# EAGLE design pyIMU_GPS (EAGLE 6.5.0)
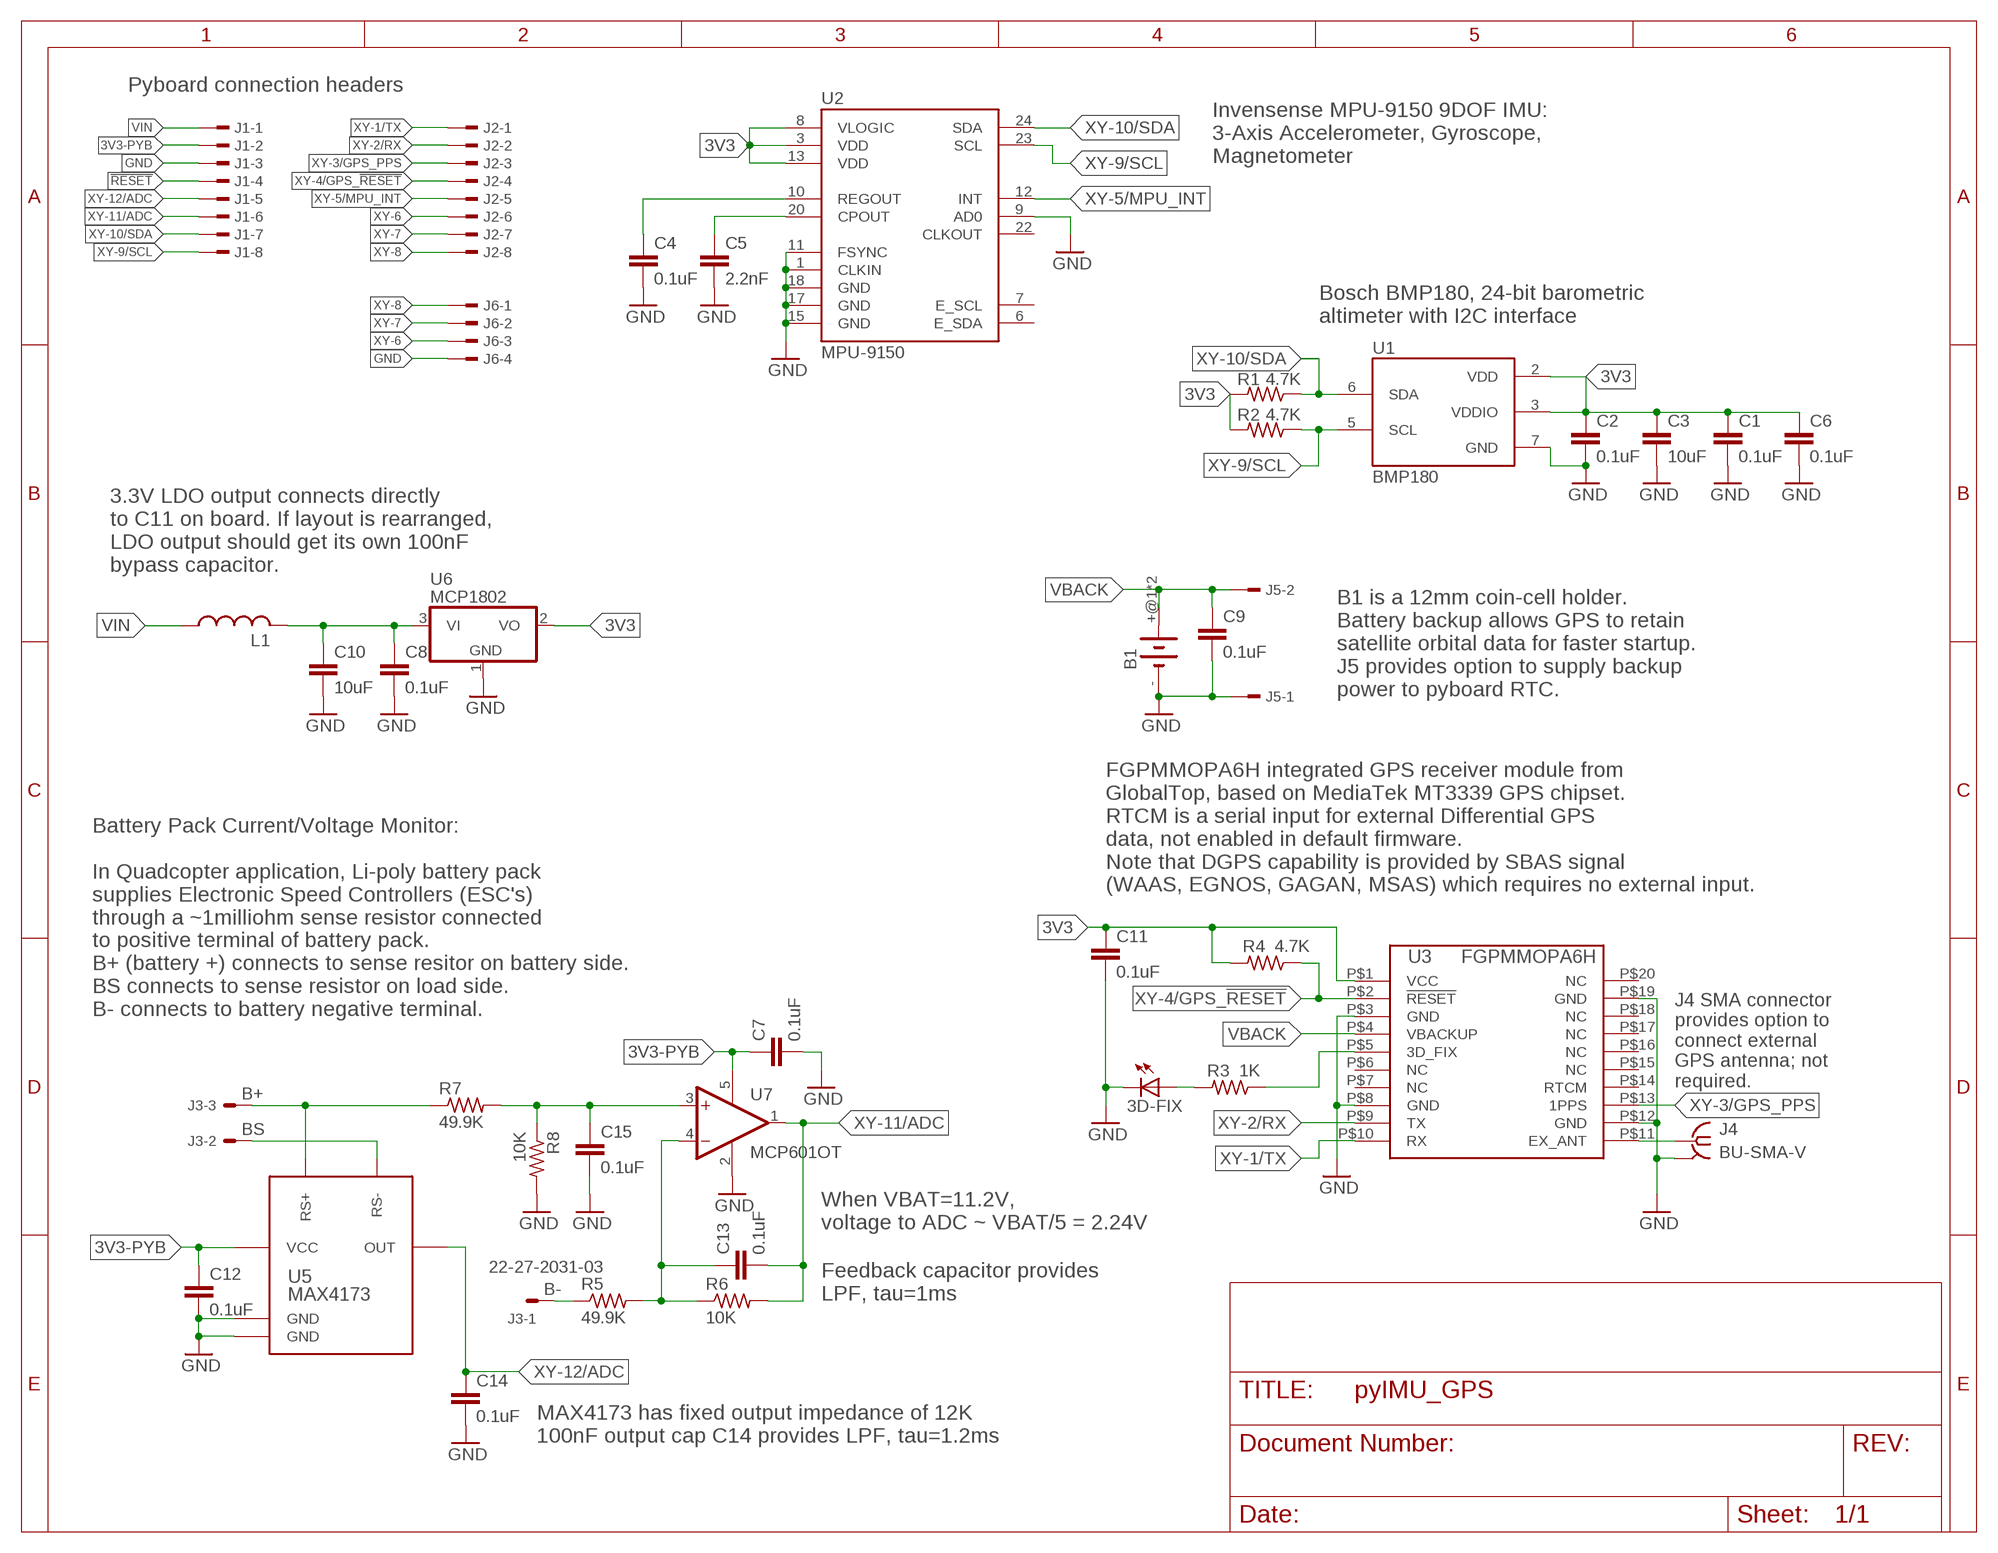
[diagram p0: schematic, sheet 1]

## Parts
3D-FIX  LEDCHIPLED_0805  [CHIPLED_0805]
B1  BATT_HOLDERK3000  [KEYSTONE-3000]
C1  0.1uF  C-EUC0603K  [C0603K]
C2  0.1uF  C-EUC0603K  [C0603K]
C3  10uF  C-EUC0805K  [C0805K]
C4  0.1uF  C-EUC0603K  [C0603K]
C5  2.2nF  C-EUC0603K  [C0603K]
C6  0.1uF  C-EUC0603K  [C0603K]
C7  0.1uF  C-EUC0603K  [C0603K]
C8  0.1uF  C-EUC0603K  [C0603K]
C9  0.1uF  C-EUC0603K  [C0603K]
C10  10uF  C-EUC0805K  [C0805K]
C11  0.1uF  C-EUC0603K  [C0603K]
C12  0.1uF  C-EUC0603K  [C0603K]
C13  0.1uF  C-EUC0603K  [C0603K]
C14  0.1uF  C-EUC0603K  [C0603K]
C15  0.1uF  C-EUC0603K  [C0603K]
J1  TSW-108-02-S-S-MOD  [TSW-108-02-S-S-MOD]
J2  TSW-108-02-S-S-MOD  [TSW-108-02-S-S-MOD]
J3  22-27-2031-03  [6410-03]
J4  BU-SMA-V  [BU-SMA-V]
J5  TSW-102-02-S-S  [TSW-102-02-S-S]
J6  TSW-104-02-S-S  [TSW-104-S-S-MOD]
L1  L-USL3216C  [L3216C]
R1  4.7K  R-US_R0603  [R0603]
R2  4.7K  R-US_R0603  [R0603]
R3  1K  R-US_R0603  [R0603]
R4  4.7K  R-US_R0603  [R0603]
R5  49.9K  R-US_R0805  [R0805]
R6  10K  R-US_R0805  [R0805]
R7  49.9K  R-US_R0805  [R0805]
R8  10K  R-US_R0805  [R0805]
U1  BMP180  [BMP180]
U2  MPU-9150  MPU-9150QFN-24-NP  [QFN-24-NP]
U3  FGPMMOPA6H  [FGPMMOPA6H]
U5  MAX4173  [SOT23-6L]
U6  MCP1802  MCP1703CB  [SOT23]
U7  MCP601OT  [SOT23-5]

## Nets
3V3: C1.1 C2.1 C3.1 C6.1 C11.1 R1.2 R2.2 R4.2 U1.2(VDD) U1.3(VDDIO) U2.3(VDD) U2.8(VLOGIC) U2.13(VDD) U3.P$1(VCC) U6.2(VO)
3V3-PYB: C7.1 C12.1 J1.2 U5.3(VCC) U7.5(V+)
!RESET: J1.4
B+: J3.3 R7.1 U5.4(RS+)
B-: J3.1 R5.1
BS: J3.2 U5.5(RS-)
GND: 3D-FIX.C B1.- C1.2 C2.2 C3.2 C4.2 C5.2 C6.2 C7.2 C8.2 C9.2 C10.2 C11.2 C12.2 C14.2 C15.2 J1.3 J4.2 J4.3 J4.4 J4.5 J5.1 J6.4 R8.2 U1.7(GND) U2.1(CLKIN) U2.9(AD0) U2.11(FSYNC) U2.15(GND) U2.17(GND) U2.18(GND) U3.P$3(GND) U3.P$8(GND) U3.P$12(GND) U3.P$19(GND) U5.1(GND) U5.2(GND) U6.1(GND) U7.2(V-)
N$1: C4.1 U2.10(REGOUT)
N$2: C5.1 U2.20(CPOUT)
N$3: J4.1 U3.P$11(EX_ANT)
N$4: R3.1 U3.P$5(3D_FIX)
N$5: 3D-FIX.A R3.2
N$6: C15.1 R7.2 R8.1 U7.3(+IN)
N$8: C13.1 R5.2 R6.1 U7.4(-IN)
N$11: C8.1 C10.1 L1.2 U6.3(VI)
VBACK: B1.+@1(+) B1.+@2(+) C9.1 J5.2 U3.P$4(VBACKUP)
VIN: J1.1 L1.1
XY-1/TX: J2.1 U3.P$10(RX)
XY-2/RX: J2.2 U3.P$9(TX)
XY-3/GPS_PPS: J2.3 U3.P$13(1PPS)
XY-4/GPS_!RESET: J2.4 R4.1 U3.P$2(!RESET)
XY-5/MPU_INT: J2.5 U2.12(INT)
XY-6: J2.6 J6.3
XY-7: J2.7 J6.2
XY-8: J2.8 J6.1
XY-9/SCL: J1.8 R2.1 U1.5(SCL) U2.23(SCL)
XY-10/SDA: J1.7 R1.1 U1.6(SDA) U2.24(SDA)
XY-11/ADC: C13.2 J1.6 R6.2 U7.1(OUT)
XY-12/ADC: C14.1 J1.5 U5.6(OUT)
Unconnected: U2.6(E_SDA) U2.7(E_SCL) U2.22(CLKOUT) U3.P$6(NC) U3.P$7(NC) U3.P$14(RTCM) U3.P$15(NC) U3.P$16(NC) U3.P$17(NC) U3.P$18(NC) U3.P$20(NC)

## Notes on the sheet
- Pyboard connection headers
- Invensense MPU-9150 9DOF IMU:
  3-Axis Accelerometer, Gyroscope,
  Magnetometer
- Bosch BMP180, 24-bit barometric 
  altimeter with I2C interface
- 3.3V LDO output connects directly
  to C11 on board. If layout is rearranged, 
  LDO output should get its own 100nF
  bypass capacitor.
- B1 is a 12mm coin-cell holder.
  Battery backup allows GPS to retain 
  satellite orbital data for faster startup. 
  J5 provides option to supply backup 
  power to pyboard RTC.
- FGPMMOPA6H integrated GPS receiver module from 
  GlobalTop, based on MediaTek MT3339 GPS chipset.
  RTCM is a serial input for external Differential GPS 
  data, not enabled in default firmware.
  Note that DGPS capability is provided by SBAS signal 
  (WAAS, EGNOS, GAGAN, MSAS) which requires no external input.
- Battery Pack Current/Voltage Monitor:
  
  In Quadcopter application, Li-poly battery pack 
  supplies Electronic Speed Controllers (ESC's)
  through a ~1milliohm sense resistor connected 
  to positive terminal of battery pack.
  B+ (battery +) connects to sense resitor on battery side.
  BS connects to sense resistor on load side.
  B- connects to battery negative terminal.
- J4 SMA connector 
  provides option to 
  connect external 
  GPS antenna; not 
  required.
- When VBAT=11.2V, 
  voltage to ADC ~ VBAT/5 = 2.24V
- Feedback capacitor provides 
  LPF, tau=1ms
- MAX4173 has fixed output impedance of 12K
  100nF output cap C14 provides LPF, tau=1.2ms

## Library data of the parts
3D-FIX = led:LED: LED OSRAM: - CHIPLED LG R971, LG N971, LY N971, LG Q971, LY Q971, LO R971, LY R971 LH N974, LH R974 LS Q976, LO Q976, LY Q976 LO Q996 - Hyper CHIPLED LW Q18S LB Q993, LB Q99A, LB R99A - SideLED LS A670, LO A670, LY A670, LG A670, LP A670 LB A673, LV A673, LT A673, LW A673 LH A674 LY A675 LS A676, LA A676, LO A676, LY A676, LW A676 LS A679, LY A679, LG A679 - Hyper Micro SIDELED® LS Y876, LA Y876, LO Y876, LY Y876 LT Y87S - SmartLED LW L88C, LW L88S LB L89C, LB L89S, LG L890 LS L89K, LO L89K, LY L89K LS L896, LA L896, LO L896, LY L896 - TOPLED LS T670, LO T670, LY T670, LG T670, LP T670 LSG T670, LSP T670, LSY T670, LOP T670, LYG T670 LG T671, LOG T671, LSG T671 LB T673, LV T673, LT T673, LW T673 LH T674 LS T676, LA T676, LO T676, LY T676, LB T676, LH T676, LSB T676, LW T676 LB T67C, LV T67C, LT T67C, LS T67K, LO T67K, LY T67K, LW E67C LS E67B, LA E67B, LO E67B, LY E67B, LB E67C, LV E67C, LT E67C LW T67C LS T679, LY T679, LG T679 LS T770, LO T770, LY T770, LG T770, LP T770 LB T773, LV T773, LT T773, LW T773 LH T774 LS E675, LA E675, LY E675, LS T675 LS T776, LA T776, LO T776, LY T776, LB T776 LHGB T686 LT T68C, LB T68C - Hyper Mini TOPLED® LB M676 - Mini TOPLED Santana® LG M470 LS M47K, LO M47K, LY M47K Source: http://www.osram.convergy.de LUXEON: - LUMILED® LXK2-PW12-R00, LXK2-PW12-S00, LXK2-PW14-U00, LXK2-PW14-V00 LXK2-PM12-R00, LXK2-PM12-S00, LXK2-PM14-U00 LXK2-PE12-Q00, LXK2-PE12-R00, LXK2-PE12-S00, LXK2-PE14-T00, LXK2-PE14-U00 LXK2-PB12-K00, LXK2-PB12-L00, LXK2-PB12-M00, LXK2-PB14-N00, LXK2-PB14-P00, LXK2-PB14-Q00 LXK2-PR12-L00, LXK2-PR12-M00, LXK2-PR14-Q00, LXK2-PR14-R00 LXK2-PD12-Q00, LXK2-PD12-R00, LXK2-PD12-S00 LXK2-PH12-R00, LXK2-PH12-S00 LXK2-PL12-P00, LXK2-PL12-Q00, LXK2-PL12-R00 Source: www.luxeon.com KINGBRIGHT: KA-3528ASYC Source: www.kingbright.com
B1 = custom:BATT_HOLDER
C1-C15 = rcl:C-EU: CAPACITOR, European symbol
J1 J2 = pyIMU-03:TSW-108-02-S-S: THROUGH-HOLE .025" SQ POST HEADER Source: Samtec TSW.pdf
J3 = pyIMU_GPS:22-?-03: CONNECTOR wire to board 2.54 mm (.1 inch) pitch header; OC_FARNELL: unknown; OC_NEWARK: unknown
J4 = pyIMU_GPS:BU-SMA-V: FEMALE SMA CONNECTOR Radiall distributor RS 112-3794; OC_FARNELL: unknown; OC_NEWARK: unknown
J5 = pyIMU_GPS:TSW-102-02-S-S: THROUGH-HOLE .025" SQ POST HEADER Source: Samtec TSW.pdf; OC_FARNELL: unknown; OC_NEWARK: unknown
J6 = pyIMU_GPS:TSW-104-02-S-S
L1 = rcl:L-US: INDUCTOR, American symbol
R1-R8 = rcl:R-US_: RESISTOR, American symbol
U1 = SparkFun-Sensors:BMP180: BOSCH BMP180 DIGITAL BAROMETRIC PRESSURE SENSOR Web page: http://www.bosch-sensortec.com/en/homepage/products_3/environmental_sensors_1/bmp180_1/bmp180 Datasheet: http://ae-bst.resource.bosch.com/media/products/dokumente/bmp180/BST-BMP180-DS000-09.pdf The BMP180 is the function compatible successor of the BMP085, a new generation of high precision digital pressure sensors for consumer applications. The ultra-low power, low voltage electronics of the BMP180 is optimized for use in mobile phones, PDAs, GPS navigation devices and outdoor equipment. With a low altitude noise of merely 0.25m at fast conversion time, the BMP180 offers superior performance. The I2C interface allows for easy system integration with a microcontroller. The BMP180 is based on piezo-resistive technology for EMC robustness, high accuracy and linearity as well as long term stability. Key features: - Temperature measurement included - I2C interface - Fully calibrated - Pb-free, halogen-free and RoHS compliant, - MSL 1 Basic specs: Pressure range: 300 to 1100hPa (+9000m to -500m relating to sea level) Supply voltage: 1.8 to 3.6V (VDD), 1.62V to 3.6V (VDDIO) Package: LGA package with metal lid Small footprint: 3.6mm x 3.8mm Super-flat: 0.93mm height Low power: 5μA at 1 sample / sec. in standard mode Low noise: 0.06hPa (0.5m) in ultra low power mode, 0.02hPa (0.17m) advanced resolution mode Typical applications: - Enhancement of GPS navigation (dead-reckoning, slope detection, etc.) - In- and out-door navigation - Leisure and sports - Weather forecast - Vertical velocity indication (rise/sink speed)
U2 = SparkFun-Sensors:MPU-9150: 9DOF (3mag, 3accel, 3rotat). I2C interface.
U3 = pyIMU_GPS:FGPMMOPA6H
U5 = custom:MAX4173
U6 = linear:MCP1703: 250 mA, 16V, Low Quiescent Current LDO Regulator Source: http://ww1.microchip.com/downloads/en/DeviceDoc/22049b.pdf
U7 = linear:MCP601: Single Op Amp 2.7V to 6.0V Single Supply CMOS Source: http://ww1.microchip.com/downloads/en/DeviceDoc/21314g.pdf

## Net classes
0 default: clearance 0.205 mm

## Board
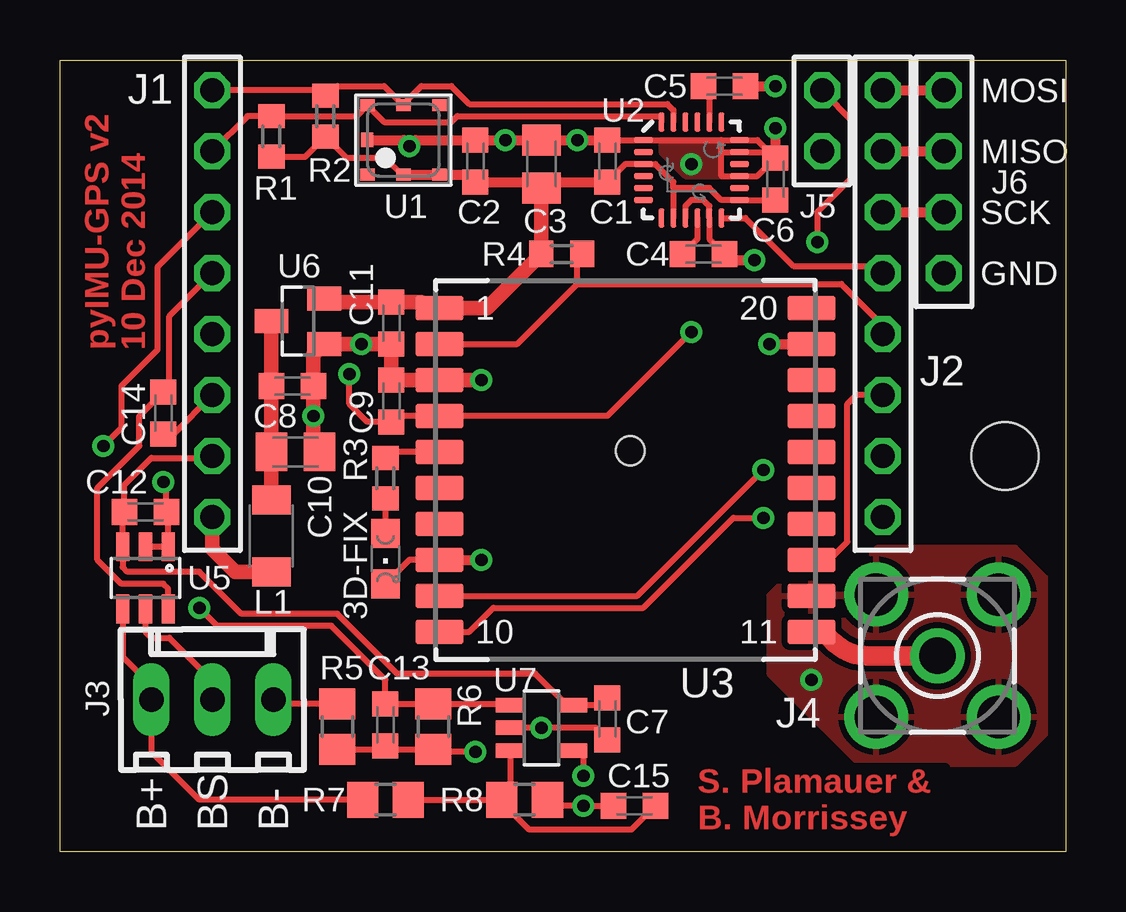
[diagram p1: board, top side]
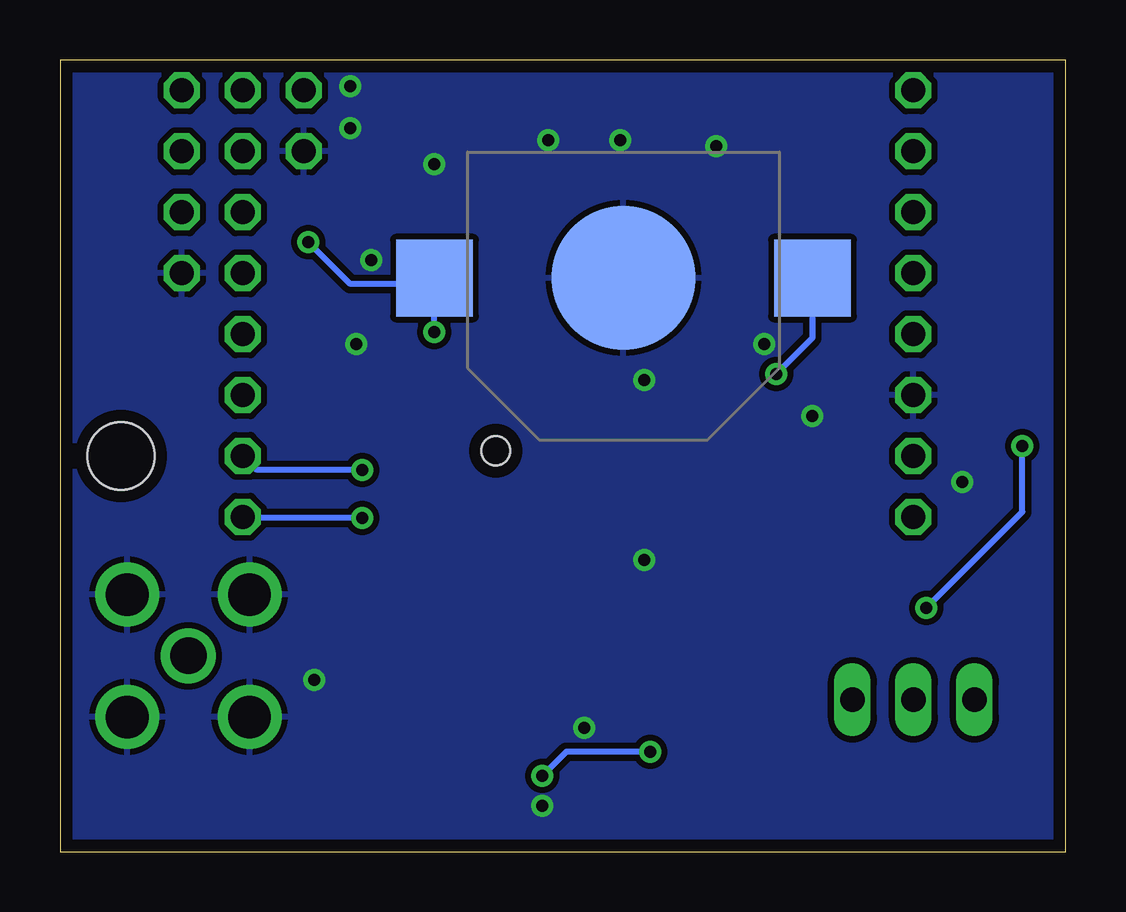
[diagram p2: board, bottom side, seen from below]

Size 41.91 x 33.02 mm. Coordinates in mm from the lower left corner, seen from the top.
Outline: 0,33.02 41.91,33.02 41.91,0 0,0 0,33.02
Copper layers (1*16): Top 0.0178mm / dielectric 59mil / Bottom 0.0178mm
Design rules "SSC-EAGLE-2Lyr_v1.0.0.3": minimum track width 6mil, minimum drill 14mil, track to track 6mil, track to pad 6mil, pad to pad 6mil, via to via 6mil, smd to smd 6mil, copper to edge 20mil, drill to drill 16mil, minimum pad ring 8mil, minimum via ring 8mil, stop-mask expansion 3mil, vias tented up to drill 0mil, thermal gap 10mil
Holes 2.8 mm at 39.37,16.51

### Footprints (pad centres in the part's own frame; a part is rotated, then mirrored left to right if it is on the bottom)
CHIPLED_0805 = smd 1.2 x 1.2: A 0,-1.05; C 0,1.05
KEYSTONE-3000 = smd 3.2 x 3.2: +@1 7.875,0; +@2 -7.875,0 | smd 6 x 6: - 0,0
C0603K = smd 1.05 x 1.08: 1 -0.875,0; 2 0.875,0
C0805K = smd 1.3 x 1.6: 1 -1,0; 2 1,0
TSW-108-02-S-S-MOD = drill 1 pad 1.5 octagon: 1 8.89,0; 2 6.35,0; 3 3.81,0; 4 1.27,0; 5 -1.27,0; 6 -3.81,0; 7 -6.35,0; 8 -8.89,0
6410-03 = drill 1.016 long: 1 2.54,0; 2 0,0; 3 -2.54,0
BU-SMA-V = drill 1.524: 1 0,0 | drill 1.778: 2 -2.55,2.55; 3 2.55,2.55; 4 2.55,-2.55; 5 -2.55,-2.55
TSW-102-02-S-S = drill 1 pad 1.5 octagon: 1 1.27,0; 2 -1.27,0
TSW-104-S-S-MOD = drill 1 pad 1.5 octagon: 1 3.81,0; 2 1.27,0; 3 -1.27,0; 4 -3.81,0
L3216C = smd 1.2 x 1.6: 1 -1.5,0; 2 1.5,0
R0603 = smd 1 x 1.1: 1 -0.85,0; 2 0.85,0
R0805 = smd 1.3 x 1.5: 1 -0.95,0; 2 0.95,0
BMP180 = smd 0.6 x 0.5: 1 1.5,1.45; 2 0,1.45; 3 -1.5,1.45; 4 -1.5,-1.45; 5 0,-1.45; 6 1.5,-1.45 | smd 0.5 x 0.6: 7 1.5,0
QFN-24-NP = smd 0.8 x 0.254: 1 -2,1.25; 2 -2,0.75; 3 -2,0.25; 4 -2,-0.25; 5 -2,-0.75; 6 -2,-1.25; 13 2,-1.25; 14 2,-0.75; 15 2,-0.25; 16 2,0.25; 17 2,0.75; 18 2,1.25 | smd 0.254 x 0.8: 7 -1.25,-2; 8 -0.75,-2; 9 -0.25,-2; 10 0.25,-2; 11 0.75,-2; 12 1.25,-2; 19 1.25,2; 20 0.75,2; 21 0.25,2; 22 -0.25,2; 23 -0.75,2; 24 -1.25,2
FGPMMOPA6H = smd 2 x 1: P$1 -7.75,6.75; P$2 -7.75,5.25; P$3 -7.75,3.75; P$4 -7.75,2.25; P$5 -7.75,0.75; P$6 -7.75,-0.75; P$7 -7.75,-2.25; P$8 -7.75,-3.75; P$9 -7.75,-5.25; P$10 -7.75,-6.75; P$11 7.75,-6.75; P$12 7.75,-5.25; P$13 7.75,-3.75; P$14 7.75,-2.25; P$15 7.75,-0.75; P$16 7.75,0.75; P$17 7.75,2.25; P$18 7.75,3.75; P$19 7.75,5.25; P$20 7.75,6.75 | hole 1.2: 0.2,0.8
SOT23-6L = smd 0.55 x 1.2: 1 -0.95,-1.3; 2 0,-1.3; 3 0.95,-1.3; 4 0.95,1.3; 5 0,1.3; 6 -0.95,1.3
SOT23 = smd 1 x 1.4: 1 -0.95,-1.1; 2 0.95,-1.1; 3 0,1.1
SOT23-5 = smd 0.6 x 1.2: 1 -0.95,-1.306; 2 0,-1.306; 3 0.95,-1.306; 4 0.95,1.306; 5 -0.95,1.306

### Placement (x,y rotation side)
3D-FIX  13.56,12.23 180 top
B1  18.43,23.93 0 bottom
C1  22.81,28.8 90 top
C2  17.31,28.8 90 top
C3  20.06,28.68 90 top
C4  26.81,24.93 0 top
C5  27.68,31.93 0 top
C6  29.81,28.05 90 top
C7  22.81,5.55 270 top
C8  9.69,19.43 0 top
C9  13.81,18.8 90 top
C10  9.81,16.68 0 top
C11  13.81,22.05 270 top
C12  3.56,14.18 0 top
C13  13.56,5.3 90 top
C14  4.31,18.3 270 top
C15  23.93,1.93 180 top
J1  6.35,22.86 270 top
J2  34.29,22.86 270 top
J3  6.35,6.35 0 top
J4  36.56,8.18 90 top
J5  31.75,30.48 270 top
J6  36.83,27.94 90 top
L1  8.81,13.18 90 top
R1  8.81,29.83 270 top
R2  11.06,30.68 270 top
R3  13.56,15.58 270 top
R4  20.91,24.93 180 top
R5  11.56,5.23 270 top
R6  15.56,5.23 90 top
R7  13.56,2.18 0 top
R8  19.36,2.18 0 top
U1  14.31,29.68 180 top
U2  26.31,28.43 0 top
U3  23.56,15.93 0 top
U5  3.56,11.43 180 top
U6  9.91,22.13 90 top
U7  20.06,5.18 270 top

### Tracks (layer width: path | path; a pad name or v marks a point on that pad's centre or on a via)
3V3
  Top 0.254: 25.56,27.68 U2.8 | 25.56,27.68 27.06,27.68 27.56,27.18 U2.13 C6.1 | 25.56,27.68 25.56,27.93 24.81,28.68 U2.3 23.56,28.68 C1.1 | R1.2 10.21,28.98 R2.2 11.96,28.93 13.56,28.93 14.26,28.23 U1.2
  Top 0.406: 20.06,27.93 C2.1 17.01,28.23 U1.3 U1.2 | C3.1 20.06,27.93 | 20.06,27.93 C1.1
  Top 0.61: C3.1 R4.2 17.81,22.68 U3.P$1 15.31,22.68 15.06,22.93 C11.1 11.16,22.93 U6.2
3V3-PYB
  Top 0.254: J1.2 6.27,16.43 3.81,16.43 2.69,15.3 C12.1 2.61,14.11 U5.3 2.61,11.88 2.81,11.68 5.81,11.68 7.56,9.93 11.56,9.93 14.06,7.43 19.81,7.43 21.11,6.13 U7.5 22.51,6.13 C7.1
B+
  Top 0.254: R7.1 5.81,2.18 3.81,4.18 J3.3 3.81,6.93 2.61,8.13 U5.4
B-
  Top 0.254: R5.1 9.06,6.18 J3.1
BS
  Top 0.254: U5.5 3.56,9.18 3.81,8.93 4.56,8.93 6.35,7.14 J3.2
GND  (via drill 0.51)
  Top 0.254: C4.2 27.06,25.55 U2.11 27.06,26.93 26.81,27.18 26.31,27.18 26.06,26.93 U2.9 | 29.56,29.18 U2.17 27.56,29.18 | 29.56,29.18 29.06,29.68 U2.18 27.56,29.68 | 29.56,29.18 C6.2 29.06,28.18 U2.15 27.56,28.18 27.56,29.18 | 27.56,29.68 U2.1 C1.2 | 27.56,29.18 27.56,29.68 | U3.P$8 14.56,12.18 3D-FIX.C | v4.31,15.43 4.44,15.3 C12.2 4.51,14.11 U5.1 U5.2 | U7.2 v20.06,5.18 22.31,5.18 C7.2 | R8.2 20.56,1.93 v21.81,1.93 C15.2 | C14.2 4.73,17.43 J1.3
  Top 0.406: C1.2 v21.56,29.68 C3.2 v18.56,29.68 C2.2 14.81,29.68 v14.56,29.43 14.31,29.68 U1.7 | v29.81,30.18 C6.2 | C4.2 27.93,24.68 v28.93,24.68 | C5.2 v29.81,31.93 | v29.56,21.18 U3.P$19 | U3.P$8 v17.56,12.18
  Top 0.61: v17.56,19.68 U3.P$3 C9.2 C11.2 U6.1 10.56,20.73 C8.2 v10.56,18.18 10.56,16.93 C10.2
  other vias: 26.31,28.68 12.56,21.18 31.31,7.18
  pour Bottom (isolate 0.254): 0.25,0.25 41.66,0.25 41.66,32.77 0.25,32.77
  pour Top (no thermals): 25.06,29.68 25.06,29.18 26.06,28.18 27.56,28.18 27.56,29.68
  pour Top (isolate 0.254): 30.06,11.18 29.56,10.68 29.56,7.43 33.31,3.68 39.81,3.68 41.06,4.93 41.06,11.43 39.81,12.68 34.06,12.68 32.56,11.18
N$1
  Top 0.254: U2.10 26.56,25.55 C4.1
N$2
  Top 0.254: C5.1 27.06,31.68 U2.20
N$3
  Top 0.813: U3.P$11 31.81,9.18 32.22,8.77 arc45 33.64,8.18 J4.1
N$4
  Top 0.254: U3.P$5 13.81,16.68 R3.1
N$5
  Top 0.254: R3.2 3D-FIX.A
N$6
  Top 0.254: R7.2 R8.1 | U7.3 18.75,2.52 R8.1 | C15.1 23.81,0.93 19.56,0.93 18.41,2.08 R8.1
N$8  (via drill 0.51)
  Top 0.254: R5.2 13.41,4.28 C13.1 13.71,4.28 R6.1 15.66,4.18 v17.31,4.18 | U7.4 21.81,4.23 v21.81,3.18
  Bottom 0.254: v17.31,4.18 20.81,4.18 v21.81,3.18
N$11
  Top 0.61: L1.2 C10.1 C8.1 U6.3
VBACK  (via drill 0.51)
  Top 0.254: v26.31,21.68 22.81,18.18 15.31,18.18 | U3.P$4 15.31,18.18 | 15.31,18.18 14.06,18.18 C9.1 12.81,17.93 12.06,18.68 v12.06,19.93 | J5.2 33.06,30.43 33.06,28.18 31.56,26.68 v31.56,25.43
  Bottom 0.254: v26.31,21.68 B1.+@2 26.56,23.68 29.81,23.68 v31.56,25.43 | B1.+@1 10.56,21.43 v12.06,19.93
VIN
  Top 0.61: J1.1 6.35,12.64 7.31,11.68 L1.1
XY-1/TX  (via drill 0.51)
  Top 0.254: U3.P$10 17.06,9.18 18.06,10.18 24.31,10.18 28.06,13.93 v29.31,13.93
  Bottom 0.254: v29.31,13.93 34.33,13.93 J2.1
XY-2/RX  (via drill 0.51)
  Top 0.254: U3.P$9 24.06,10.68 v29.31,15.93
  Bottom 0.254: v29.31,15.93 33.71,15.93 J2.2
XY-3/GPS_PPS
  Top 0.254: U3.P$13 32.06,12.18 32.81,12.93 32.81,18.68 33.18,19.05 J2.3
XY-4/GPS_!RESET
  Top 0.254: 21.56,23.68 32.56,23.68 34.29,21.95 J2.4 | U3.P$2 19.06,21.18 21.56,23.68 | 21.56,23.68 21.56,24.73 R4.1
XY-5/MPU_INT
  Top 0.254: U2.12 28.56,26.43 30.56,24.43 33.99,24.43 J2.5
XY-6
  Top 0.406: J2.6 J6.3
XY-7
  Top 0.406: J2.7 J6.2
XY-8
  Top 0.406: J2.8 J6.1
XY-9/SCL
  Top 0.254: U2.23 25.56,30.93 25.31,31.18 17.06,31.18 16.31,31.93 15.06,31.93 14.31,31.18 U1.5 13.51,31.93 11.56,31.93 11.16,31.53 R2.1 10.84,31.75 J1.8
XY-10/SDA
  Top 0.254: U2.24 25.06,30.68 16.56,30.68 16.31,30.43 13.51,30.43 U1.6 12.36,30.68 R1.1 7.82,30.68 J1.7
XY-11/ADC  (via drill 0.51)
  Top 0.254: v1.81,16.93 2.56,17.68 2.56,19.43 4.06,20.93 4.06,24.38 J1.6 | v5.81,10.18 6.56,9.43 11.31,9.43 13.56,7.18 C13.2 R6.2 18.7,6.18 U7.1
  Bottom 0.254: v5.81,10.18 1.81,14.18 v1.81,16.93
XY-12/ADC
  Top 0.254: U5.6 4.51,10.98 4.31,11.18 2.56,11.18 1.56,12.18 1.56,15.18 3.31,16.93 3.31,18.18 C14.1 4.56,19.43 4.56,22.34 J1.5

### Text on the board
Top: pyIMU-GPS v2 / 10 Dec 2014 | S. Plamauer & / B. Morrissey
tPlace: MOSI | MISO | SCK | GND | B+ | BS | B-